# Altium schematic sheet AMRadio.SchDoc
size C
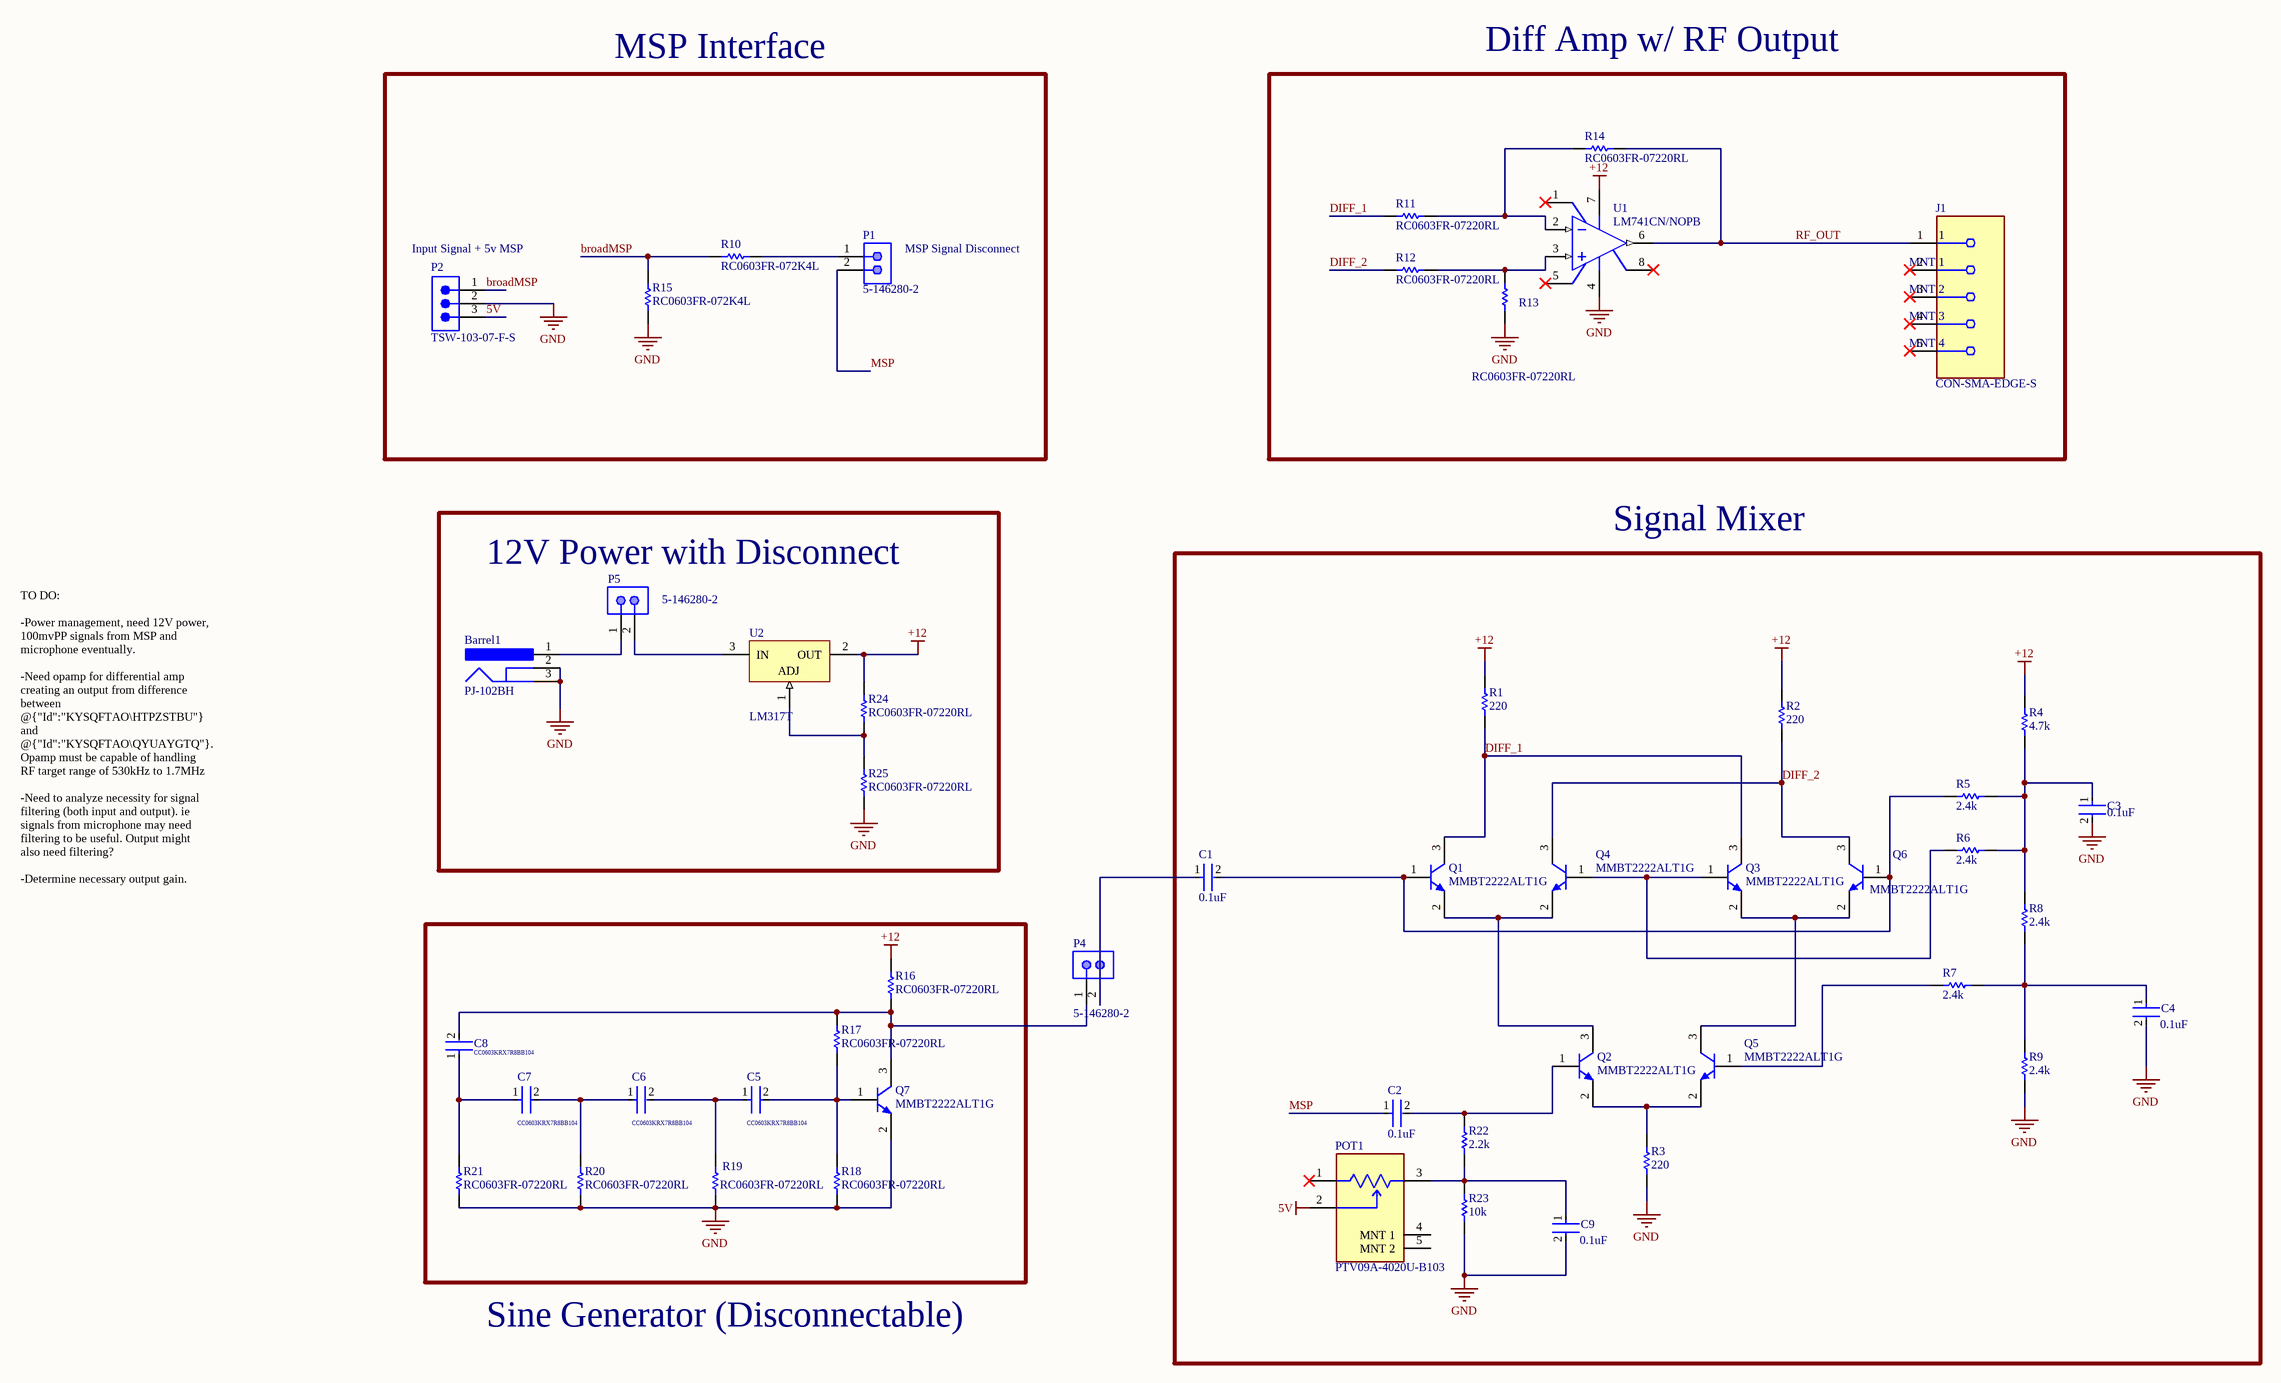
[diagram p0: AMRadio.SchDoc]

## Parts
Barrel1  PJ-102BH  [CUI-PJ-102BH_V]
C1  0.1uF  [FP-CC0603-DA-MFG]
C2  0.1uF  [FP-CC0603-DA-MFG]
C3  0.1uF  [FP-CC0603-DA-MFG]
C4  0.1uF  [FP-CC0603-DA-MFG]
C5  CC0603KRX7R8BB104  [FP-CC0603-DA-MFG]
C6  CC0603KRX7R8BB104  [FP-CC0603-DA-MFG]
C7  CC0603KRX7R8BB104  [FP-CC0603-DA-MFG]
C8  CC0603KRX7R8BB104  [FP-CC0603-DA-MFG]
C9  0.1uF  [FP-CC0603-DA-MFG]
J1  CON-SMA-EDGE-S  [FP-CON-SMA-EDGE-S-MFG]
P1  5-146280-2  [TECO-5-146280-2_V]
P2  TSW-103-07-F-S  [SMTC-TSW-103-07-X-S]
P4  5-146280-2  [TECO-5-146280-2_V]
P5  5-146280-2  [TECO-5-146280-2_V]
POT1  PTV09A-4020U-B103  [FP-PTV09A-4-MFG]
Q1  MMBT2222ALT1G  [ONSC-SOT-23-3-318-08_V]
Q2  MMBT2222ALT1G  [ONSC-SOT-23-3-318-08_V]
Q3  MMBT2222ALT1G  [ONSC-SOT-23-3-318-08_V]
Q4  MMBT2222ALT1G  [ONSC-SOT-23-3-318-08_V]
Q5  MMBT2222ALT1G  [ONSC-SOT-23-3-318-08_V]
Q6  MMBT2222ALT1G  [ONSC-SOT-23-3-318-08_V]
Q7  MMBT2222ALT1G  [ONSC-SOT-23-3-318-08_V]
R1  220  [RESC1608X55X25ML10T15]
R2  220  [RESC1608X55X25ML10T15]
R3  220  [RESC1608X55X25ML10T15]
R4  4.7k  [RESC1608X55X25LL10T15]
R5  2.4k  [RESC1608X55X25LL10T15]
R6  2.4k  [RESC1608X55X25LL10T15]
R7  2.4k  [RESC1608X55X25LL10T15]
R8  2.4k  [RESC1608X55X25LL10T15]
R9  2.4k  [RESC1608X55X25LL10T15]
R10  RC0603FR-072K4L  [RESC1608X55X25LL10T15]
R11  RC0603FR-07220RL  [RESC1608X55X25ML10T15]
R12  RC0603FR-07220RL  [RESC1608X55X25ML10T15]
R13  RC0603FR-07220RL  [RESC1608X55X25ML10T15]
R14  RC0603FR-07220RL  [RESC1608X55X25ML10T15]
R15  RC0603FR-072K4L  [RESC1608X55X25LL10T15]
R16  RC0603FR-07220RL  [RESC1608X55X25ML10T15]
R17  RC0603FR-07220RL  [RESC1608X55X25ML10T15]
R18  RC0603FR-07220RL  [RESC1608X55X25ML10T15]
R19  RC0603FR-07220RL  [RESC1608X55X25ML10T15]
R20  RC0603FR-07220RL  [RESC1608X55X25ML10T15]
R21  RC0603FR-07220RL  [RESC1608X55X25ML10T15]
R22  2.2k  [RESC1608X55X25ML10T15]
R23  10k  [RESC1608X55X25ML10T15]
R24  RC0603FR-07220RL  [RESC1608X55X25ML10T15]
R25  RC0603FR-07220RL  [RESC1608X55X25ML10T15]
U1  LM741CN/NOPB  [P0008A]
U2  LM317T  [TO-220]

## Blocks framed on the sheet
MSP Interface: P1 P2 R10 R15
Diff Amp w/ RF Output: J1 R11-R14 U1
12V Power with Disconnect: Barrel1 P5 R24 R25 U2
Signal Mixer: C1-C4 C9 POT1 Q1-Q6 R1-R9 R22 R23

## Nets
5V: P2.3 POT1.2
+12: R1.1 R2.1 R4.2 R16.1 R24.1 U1.7(V+) U2.2(OUT)
GND: Barrel1.2 Barrel1.3 C3.2 C4.2 C9.2 P2.2 Q7.2(E) R3.2 R9.2 R13.2 R15.1 R18.2 R19.2 R20.2 R21.2 R23.2 R25.2 U1.4(V-)
broadMSP: P2.1 R10.2 R15.2
DIFF_1: Q1.3(C) Q3.3(C) R1.2 R11.1
DIFF_2: Q4.3(C) Q6.3(C) R2.2 R12.1
MSP: C2.1 P1.2
RF_OUT: J1.1 R14.2 U1.6(OUT)
NetBarrel1_1: Barrel1.1 P5.1
NetC1_1: C1.1 P4.2
NetC1_2: C1.2 Q1.1(B) Q6.1(B) R5.1
NetC2_2: C2.2 Q2.1(B) R22.1
NetC3_1: C3.1 R4.1 R5.2 R6.2 R8.1
NetC4_1: C4.1 R7.2 R8.2 R9.1
NetC5_1: C5.1 C6.2 R19.1
NetC5_2: C5.2 Q7.1(B) R17.2 R18.1
NetC6_1: C6.1 C7.2 R20.1
NetC7_1: C7.1 C8.1 R21.1
NetC8_2: C8.2 P4.1 Q7.3(C) R16.2 R17.1
NetC9_1: C9.1 POT1.3 R22.2 R23.1
NetP1_1: P1.1 R10.1
NetP5_2: P5.2 U2.3(IN)
NetQ1_2: Q1.2(E) Q2.3(C) Q4.2(E)
NetQ2_2: Q2.2(E) Q5.2(E) R3.1
NetQ3_1: Q3.1(B) Q4.1(B) R6.1
NetQ3_2: Q3.2(E) Q5.3(C) Q6.2(E)
NetQ5_1: Q5.1(B) R7.1
NetR11_2: R11.2 R14.1 U1.2(IN-)
NetR12_2: R12.2 R13.1 U1.3(IN+)
NetR24_2: R24.2 R25.1 U2.1(ADJ)

Not connected (* = marked no-connect by the designer): J1 2(MNT_1)* 3(MNT_2)* 4(MNT_3)* 5(MNT_4)*; POT1 1* 4(MNT_1) 5(MNT_2); U1 1(OFS_NULL)* 5(OFS_NULL)* 8(NC)*

## Notes on the sheet
- (near P2) Input Signal + 5v MSP
- (near P1) MSP Signal Disconnect
- TO DO:
  -Power management, need 12V power, 100mvPP signals from MSP and microphone eventually.
  -Need opamp for differential amp creating an output from difference between @{"Id":"KYSQFTAO\HTPZSTBU"} and @{"Id":"KYSQFTAO\QYUAYGTQ"}.
  Opamp must be capable of handling RF target range of 530kHz to 1.7MHz
  -Need to analyze necessity for signal filtering (both input and output). ie signals from microphone may need filtering to be useful. Output might also need filtering?
  -Determine necessary output gain. Maybe want to make it adjustable with a potentiometer?
- Sine Generator (Disconnectable)

## Library data of the parts
Barrel1 = CMP-2000-06901-1: Through Hole Right Angle DC Power Jack, 5 A, 2.5 mm Center Pin, 3 Position, -25 to 85 degC, RoHS, Bulk; Manufacturer: CUIInc.; Outside Contact Diameter: 6.5mm; Current Rating: 5A; Brand: CUI; Insulation Resistance: 100MOhms; Inside Contact Diameter: 2.5mm; Voltage Rating: 24V; Operating Temperature Range: -25Cto+85C; Mounting Angle: Right; Mounting Technology: ThroughHole; Product Category: DCPowerConnectors; Datasheet Version: Rev. 1.02, 05/2016; Connector Type: DCPowerJack; Contact Material: Copper; Housing Material: PolybutyleneTerephthalate(PBT); Mounting Style: ThroughHole; Product: Jacks; Package Reference: PJ-102BH; Manufacturer URL: http://www.cui.com/; RoHS: True; Contact Gender: Male; Contact Plating: Nickel; Flammability Rating: UL94V-0; Factory Pack Quantity: 280; Datasheet URL: http://www.cui.com/product/resource/pj-102bh.pdf; Package Description: 3-Pin Through Hole Device, Body 14.4 x 9 mm, Height 11 mm; Termination Style: ThroughHole
C1-C4 C9 = CMP-03422-000234-1: CAP CER 0.1UF 25V X7R 0603; Manufacturer: YAGEO; Manufacturer Part Number: CC0603KRX7R8BB104; Capacitance: 100 nF; Tolerance: 0.1; Temperature Coefficient: 15%; Material: Ceramic; Value: 100 nF; Category: Cap; ComponentLink2URL: http://www.yageo.com/documents/recent/UPY-GPHC_X7R_6.3V-to-50V_18.pdf; Voltage Rating: 25 V; ComponentLink2Description: Datasheet; RoHS: TRUE; Octopart: https://octopart.com/cc0603krx7r8bb104-yageo-8376534; Mouser Description: CC Series 0603 0.1 uF 25 V ±10% Tolerance X7R SMT Multilayer Ceramic Capacitor; Device Class L2: Capacitors; Automotive: No; Temperature Range Low: -55°C; Lead Free: Yes; Temperature Range High: +125°C; Package: CC0603-DA; Temperature: -55°C to +125°C; Footprint Url: http://www.yageo.com/exep/pages/download/literatures/UPY-C_GEN_24.pdf; Height: 0.9mm; Voltage: 25 V; Temperature Characteristic: X7R; Device Class L3: Ceramic Capacitors; Digikey Description: CAP CER 0.1UF 25V X7R 0603; Device Class L1: Passive Components
C5-C8 = CMP-03422-000234-1: CAP CER 0.1UF 25V X7R 0603; Manufacturer: YAGEO; Capacitance: 100 nF; Tolerance: 0.1; Temperature Coefficient: 15%; Material: Ceramic; Value: 100 nF; Category: Cap; ComponentLink2URL: http://www.yageo.com/documents/recent/UPY-GPHC_X7R_6.3V-to-50V_18.pdf; Voltage Rating: 25 V; ComponentLink2Description: Datasheet; RoHS: TRUE; Octopart: https://octopart.com/cc0603krx7r8bb104-yageo-8376534; Manufacturer Part Number: CC0603KRX7R8BB104; Mouser Description: CC Series 0603 0.1 uF 25 V ±10% Tolerance X7R SMT Multilayer Ceramic Capacitor; Device Class L2: Capacitors; Automotive: No; Temperature Range Low: -55°C; Lead Free: Yes; Temperature Range High: +125°C; Package: CC0603-DA; Temperature: -55°C to +125°C; Footprint Url: http://www.yageo.com/exep/pages/download/literatures/UPY-C_GEN_24.pdf; Height: 0.9mm; Voltage: 25 V; Temperature Characteristic: X7R; Device Class L3: Ceramic Capacitors; Digikey Description: CAP CER 0.1UF 25V X7R 0603; Device Class L1: Passive Components
J1 = CMP-204357-000001-1: CONN SMA JACK STR EDGE MNT; Manufacturer: RF Solutions Ltd.; Impedance: 50Ω; Conn Orientation: Right Angle; Is Female: yes; Number Of Contacts: 1; Frequency: 18GHz; Shielding: true; Category: Conn; ComponentLink2URL: https://www.rfsolutions.co.uk/downloads/1498648656DS-CON-EDGE-SMA-4.pdf; Octopart: https://octopart.com/con-sma-edge-s-rf+solutions-70967450; Package: CONN_JACK; Manufacturer Part Number: CON-SMA-EDGE-S; Height: 6.35mm; Device Class L1: Connectors; Footprint Url: https://forum.upverter.com/uploads/default/original/3X/b/e/be75b907af57498775929d6d9099689c472e0307.pdf; Contact Material: Gold; ComponentLink2Description: Datasheet; Device Class L2: RF / Coaxial Connectors; RoHS: TRUE; Device Class L3: unset; Digikey Description: CONN SMA JACK STR EDGE MNT; Lead Free: Yes; Automotive: No
P1 P4 P5 = CMP-2000-07492-1: Male Header, Pitch 2.54 mm, 1 x 2 Position, Height 8.21 mm, Tail Length 3.05 mm, -65 to 105 degC, RoHS, Bulk; Manufacturer: TE Connectivity; Mating Connector Lock: No(Without); Number of Positions: 2; Pitch: 2.54mm; PCB Mounting Orientation: Vertical; Keyed: No; Case\/Package: 100; Mating Post Length: 0.23inch; High Temperature Housing: Yes; Max Current Rating: 5A; PCB Thickness: 0.063inch; PCB Mount Retention: Without; Approvals: CSA; Current Rating: 3A; Radiation Hardening: No; Length: 4.67mm; Contact Mating Length: 0.23inch; Connector Type: Header; Number of Rows: 1; Termination Post Length: 0.12inch; Board Standoff: No(Without); Max Operating Temperature: 105degC; Contact Shape: Square; Selectively Loaded: No(Without); Gasket: No(Without); Number of Contacts: 2; Contact Gender: Male; Mating Alignment: No(Without); Manufacturer URL: http://www.te.com/; Datasheet URL: http://www.te.com/commerce/DocumentDelivery/DDEController?Action=showdoc&DocId=Customer+Drawing%7F146280%7FH1%7Fpdf%7FEnglish%7FENG_CD_146280_H1.pdf%7F5-146280-2; Mount: ThroughHole; Orientation: Straight; Packaging: Carton; Package Reference: 5-146280-2; Package Quantity: 500; Stabilizers: No(Without); Row Spacing: 2.54mm; Contact Material: CopperAlloy; Panel Mount Retention: No(Without); Datasheet Version: Rev. H1, 08/2016; Housing Colour: Black; Colour: Black; Package Description: Male Header, Pitch 2.54 mm, 1 x 2 Position, Height 8.21 mm, Tail Length 3.05 mm; Contact Plating: Matte; Housing Material: Polymer; Contact Protection: No(Without); Min Operating Temperature: -65degC; Mounting Technology: ThroughHole; Flammability Rating: UL94V-0; RoHSCompliant: true; Termination: ThroughHole; Depth: 2.34mm; High Speed Serial Data Connector: No
P2 = CMP-1024-00331-1: 0.025" SQ Post Header, Through-hole, Vertical, -55 to 125 degC, 2.54 mm Pitch, 3-Pin, Male, RoHS; Manufacturer: Samtec; Pitch: 2.54 mm; DatasheetVersion: F-214; ComponentLink1Description: Manufacturer URL; ComponentLink3URL: http://www.samtec.com/documents/webfiles/cpdf/TSW-XXX-XX-XXX-X-XX-XXX-MKT.pdf; Mounting Technology: Through-hole; PackageDescription: .025[0.64] SQ. Post Terminal Strip Assembly; Temperature Range: -55 to 125 degC; ComponentLink3Description: Package Specification; Orientation: Vertical; PartNumber: TSW-103-07-F-S; RoHS: True; PackageVersion: DM, 8/1988; ComponentLink2Description: Datasheet; ComponentLink1URL: http://www.samtec.com; ComponentLink2URL: http://www.samtec.com/documents/webfiles/pdf/TSW_TH.PDF; PackageReference: TSW-103-07-X-S
POT1 = CMP-07234-000013-1: POT 10K OHM 1/20W CARBON LINEAR; Manufacturer: Bourns Inc.; Voltage Rating: 50V; Resistance: 10kΩ; Tolerance: 20%; Value: 10kΩ; Power Rating: 0.05W; Composition: Carbon; Lead Free: Yes; Device Class L1: Passive Components; Device Class L3: Variable Resistors and Potentiometers; Temperature: -10°C to +50°C; Series: PTV09; Manufacturer Part Number: PTV09A-4020U-B103; Device Class L2: Resistors; Temperature Range Low: -10°C; Height: 20.5mm; Temperature Range High: +50°C; Octopart: https://octopart.com/ptv09a-4020u-b103-bourns-1878033; Digikey Description: POT 10K OHM 1/20W CARBON LINEAR; RoHS: TRUE; ComponentLink2URL: https://www.bourns.com/docs/product-datasheets/ptv09.pdf?sfvrsn=5e1089f1_12; Package: PTV09A-4; Mouser Description: Potentiometers 10K LINEAR 20%; Category: Res; ComponentLink2Description: Datasheet; Automotive: No
Q1-Q7 = CMP-1048-00538-1: General Purpose Transistor, NPN Silicon, 3-Pin SOT-23, Pb-Free, Tape and Reel; Manufacturer: On Semiconductor; fT Min (MHz): 300; IC Continuous (A): 0.6; ComponentLink3URL: http://www.onsemi.cn/pub_link/Collateral/318-08.PDF; PartNumber: MMBT2222ALT1G; RoHS: TRUE; ComponentLink1URL: http://www.onsemi.com/; ComponentLink3Description: Package Specification; ComponentLink2Description: Datasheet; Mounting Technology: Surface Mount; Packing: Tape and Reel; PackageDescription: 3-Pin Small Outline Transistor, Body 2.92 x 1.3 mm, Pitch 0.95 mm; DatasheetVersion: Rev. 10; PackageReference: SOT-23-3-318-08; ComponentLink2URL: http://www.onsemi.cn/pub_link/Collateral/MMBT2222LT1-D.PDF; Polarity: NPN; PackageVersion: Rev. AP, 11/2009; ComponentLink1Description: Manufacturer URL
R1-R3 R11-R14 R16-R23 = CMP-1659-00018-2: General Purpose Chip Resistors, 220 Ohm, +/- 1%, -55 to 155 degC, 0603 (1608 Metric), RoHS, Tape and Reel; RoHSCompliant: false; DatasheetVersion: Rev. 4, 04/2009; ComponentLink2Description: Datasheet; ComponentLink2URL: https://datasheet.ciiva.com/11808/0900766b80f96399-11808136.pdf; ComponentLink1URL: http://www.yageo.com/; ComponentLink1Description: Manufacturer URL; PackageReference: 0603; PackageDescription: 2-Pin Surface Mount Device, Body 1.6 x 0.8 mm
R4 R10 R15 = CMP-2000-06935-1: Chip Resistor, 4.7 kOhm, +/- 1%, 0.1 W, -55 to 155 degC, 0603 (1608 Metric), RoHS, Tape and Reel; Manufacturer: Yageo; Power (Watts): 0.1W,1/10W; PCN Other: RC/AC0603/0805/120622/Jan/2013; Other Names: 311-2.40KHRCT; Resistance (Ohms): 2.4k; Online Catalog: RC0603Series; HTML Datasheet: RCSeries,LSuffixDatasheet.html; EDA / CAD Models: DownloadfromAcceleratedDesigns; Temperature Coefficient: ±100ppm/°C; Kits: PHH4-KIT-ND-RESKIT1K-9.76K1/10W5700PCS; Catalog Drawings: ThickFilmResistorSide; Family: ChipResistor-SurfaceMount; Package Description: 2-Pin Surface Mount Device, Body 1.6 x 0.8 mm; Composition: ThickFilm; Mounting Technology: SurfaceMount; Number of Terminations: 2; Package / Case: 0603(1608Metric); Datasheet Version: Rev. 7, 05/2017; Supplier Device Package: 0603; Height: 0.022"(0.55mm); Package Reference: 0603; Features: MoistureResistant; Datasheet URL: http://www.yageo.com/documents/recent/PYu-RC_Group_51_RoHS_L_7.pdf; Operating Temperature: -55°C~155°C; Packaging: CutTape(CT); Product Training Modules: ChipResistor; Standard Package: 1; Size / Dimension: 0.063"Lx0.031"W(1.60mmx0.80mm); Manufacturer URL: http://www.yageo.com/; Tolerance: ±1%; Category: Resistors; Series: RC
R5-R9 = CMP-2000-06935-1: Chip Resistor, 2.4 kOhm, +/- 1%, 0.1 W, -55 to 155 degC, 0603 (1608 Metric), RoHS, Tape and Reel; Manufacturer: Yageo; Power (Watts): 0.1W,1/10W; PCN Other: RC/AC0603/0805/120622/Jan/2013; Other Names: 311-2.40KHRCT; Online Catalog: RC0603Series; HTML Datasheet: RCSeries,LSuffixDatasheet.html; EDA / CAD Models: DownloadfromAcceleratedDesigns; Temperature Coefficient: ±100ppm/°C; Kits: PHH4-KIT-ND-RESKIT1K-9.76K1/10W5700PCS; Catalog Drawings: ThickFilmResistorSide; Family: ChipResistor-SurfaceMount; Package Description: 2-Pin Surface Mount Device, Body 1.6 x 0.8 mm; Composition: ThickFilm; Mounting Technology: SurfaceMount; Resistance (Ohms): 2.4k; Number of Terminations: 2; Package / Case: 0603(1608Metric); Datasheet Version: Rev. 7, 05/2017; Supplier Device Package: 0603; Height: 0.022"(0.55mm); Package Reference: 0603; Features: MoistureResistant; Datasheet URL: http://www.yageo.com/documents/recent/PYu-RC_Group_51_RoHS_L_7.pdf; Operating Temperature: -55°C~155°C; Packaging: CutTape(CT); Product Training Modules: ChipResistor; Standard Package: 1; Size / Dimension: 0.063"Lx0.031"W(1.60mmx0.80mm); Manufacturer URL: http://www.yageo.com/; Tolerance: ±1%; Category: Resistors; Series: RC
R24 = CMP-1659-00018-2: General Purpose Chip Resistors, 560 Ohm, +/- 1%, -55 to 155 degC, 0603 (1608 Metric), RoHS, Tape and Reel; RoHSCompliant: false; DatasheetVersion: Rev. 4, 04/2009; ComponentLink2Description: Datasheet; ComponentLink2URL: https://datasheet.ciiva.com/11808/0900766b80f96399-11808136.pdf; ComponentLink1URL: http://www.yageo.com/; ComponentLink1Description: Manufacturer URL; PackageReference: 0603; PackageDescription: 2-Pin Surface Mount Device, Body 1.6 x 0.8 mm
R25 = CMP-1659-00018-2: General Purpose Chip Resistors, 5000 Ohm, +/- 1%, -55 to 155 degC, 0603 (1608 Metric), RoHS, Tape and Reel; RoHSCompliant: false; DatasheetVersion: Rev. 4, 04/2009; ComponentLink2Description: Datasheet; ComponentLink2URL: https://datasheet.ciiva.com/11808/0900766b80f96399-11808136.pdf; ComponentLink1URL: http://www.yageo.com/; ComponentLink1Description: Manufacturer URL; PackageReference: 0603; PackageDescription: 2-Pin Surface Mount Device, Body 1.6 x 0.8 mm
U1 = CMP-0055-00162-3: Operational Amplifier, 8-pin MDIP, Pb-Free; Manufacturer: Texas Instruments; PackageTopMarking: NSUZXYTTE#*LM*741CN; PowerWise: N; CompType: Amplifiers; ComponentLink1Description: Datasheet URL; ComponentLink1URL: http://www.ti.com/general/docs/lit/getliterature.tsp?genericPartNumber=LM741&fileType=pdf; PackageDescription: MDIP, .365 x .250 x .130in, 8 Lead, .100in Pitch; RoHS: Y; PinCount: 8; Code_JEDEC: MS-001-BA; Package Reference: P0008A
U2 = CMP-0244-00444-1: 1.5A, 1.2V to 37V Adjustable Voltage Regulator, 3-Pin TO-220; PackageVersion: 2011; ComponentLink1URL: http://www.st.com; ComponentLink2URL: http://www.st.com/internet/com/TECHNICAL_RESOURCES/TECHNICAL_LITERATURE/DATASHEET/CD00000455.pdf; PackageDescription: TO, Thru-Hole, Vertical, Heatsink Mounted; 3 In-Line Leads; Pitch 2.54 mm; PackageReference: TO-220; ComponentLink1Description: Manufacturer URL; ComponentLink3URL: http://www.st.com/internet/com/TECHNICAL_RESOURCES/TECHNICAL_LITERATURE/PACKAGE_INFORMATION/CD00004649.pdf; DatasheetVersion: 1/11/2011; ComponentLink2Description: Datasheet; ComponentLink3Description: Package Specification